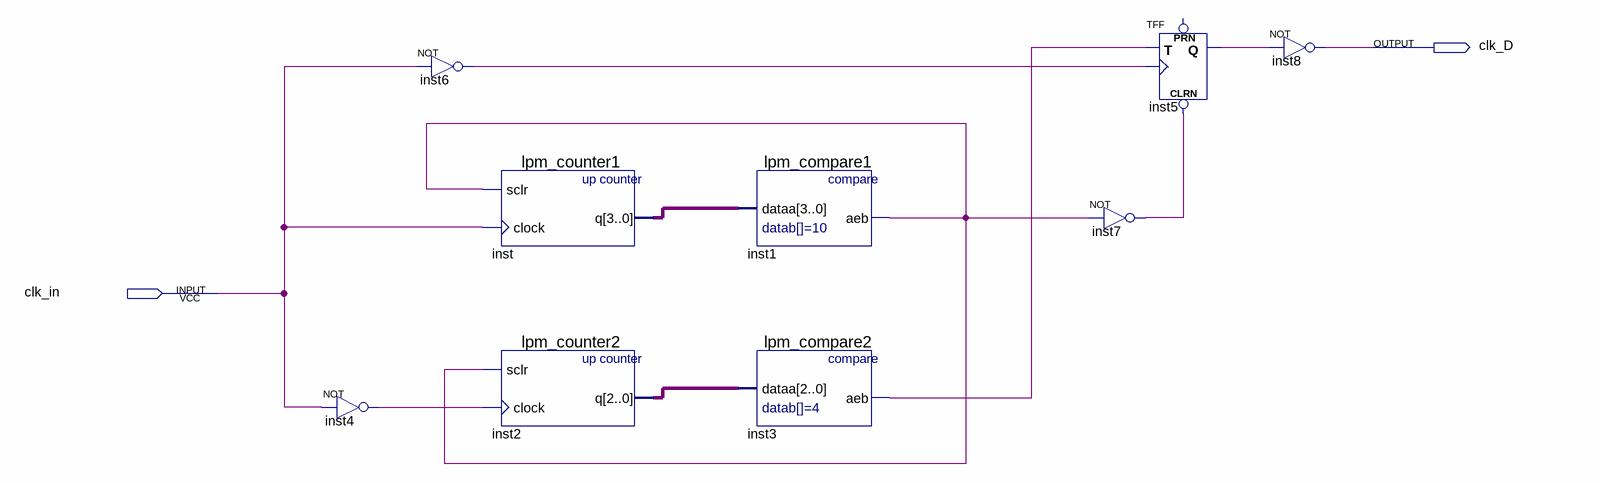
[diagram p0: schematic sheet]
// Quartus schematic BlockB.bdf as structural Verilog: 9 symbols, 2 pins
module BlockB (
  input  clk_in,
  output clk_D
);

  wire inst1_aeb, inst3_aeb, inst4_out, inst5_q, inst6_out, inst7_out;
  wire [2:0] inst2_q;
  wire [3:0] inst_q;

  not inst4 (inst4_out, clk_in);
  not inst6 (inst6_out, clk_in);
  lpm_counter1 inst (.sclr(inst1_aeb), .clock(clk_in), .q(inst_q));
  lpm_counter2 inst2 (.sclr(inst1_aeb), .clock(inst4_out), .q(inst2_q));
  lpm_compare1 inst1 (.dataa(inst_q), .aeb(inst1_aeb));
  lpm_compare2 inst3 (.dataa(inst2_q), .aeb(inst3_aeb));
  not inst7 (inst7_out, inst1_aeb);
  TFF inst5 (.CLRN(inst7_out), .T(inst3_aeb), .CLK(inst6_out), .Q(inst5_q));  // open: PRN
  not inst8 (clk_D, inst5_q);
endmodule
